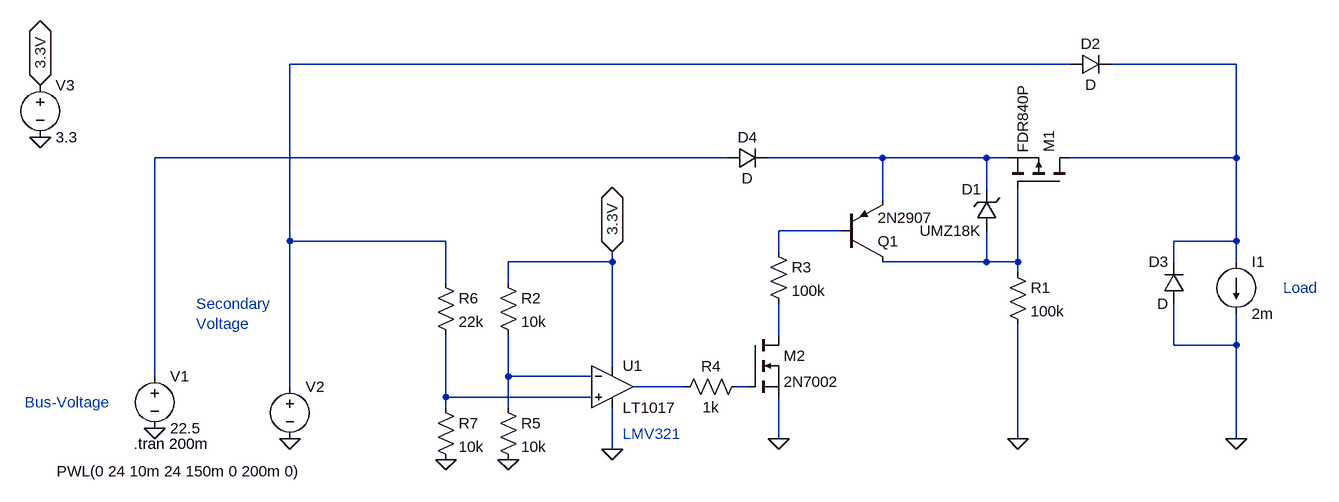
[diagram p0: schematic BusVoltage_Cutoff_OPA.asc]
BusVoltage_Cutoff_OPA.asc, the LTspice schematic file:
Version 4
SHEET 1 1240 680
WIRE 464 -368 -736 -368
WIRE 720 -368 528 -368
WIRE -64 -224 -944 -224
WIRE 176 -224 0 -224
WIRE 336 -224 176 -224
WIRE 368 -224 336 -224
WIRE 720 -224 720 -368
WIRE 720 -224 464 -224
WIRE 336 -176 336 -224
WIRE 176 -160 176 -224
WIRE 112 -112 16 -112
WIRE -736 -96 -736 -368
WIRE -496 -96 -736 -96
WIRE 720 -96 720 -224
WIRE 720 -96 624 -96
WIRE 16 -80 16 -112
WIRE -240 -64 -240 -80
WIRE -240 -64 -400 -64
WIRE 336 -64 336 -112
WIRE 336 -64 176 -64
WIRE 384 -64 384 -176
WIRE 384 -64 336 -64
WIRE 624 -64 624 -96
WIRE 720 -64 720 -96
WIRE 384 -48 384 -64
WIRE -496 -32 -496 -96
WIRE -400 -32 -400 -64
WIRE 16 48 16 0
WIRE 624 64 624 0
WIRE 720 64 720 16
WIRE 720 64 624 64
WIRE -240 96 -240 -64
WIRE -944 112 -944 -224
WIRE -400 112 -400 48
WIRE -272 112 -400 112
WIRE -736 128 -736 -96
WIRE -128 128 -208 128
WIRE -32 128 -48 128
WIRE -496 144 -496 48
WIRE -272 144 -496 144
WIRE -496 160 -496 144
WIRE -400 160 -400 112
WIRE 16 208 16 144
WIRE 384 208 384 32
WIRE 720 208 720 64
WIRE -240 224 -240 160
FLAG -944 192 0
FLAG 384 208 0
FLAG 720 208 0
FLAG -736 208 0
FLAG 16 208 0
FLAG -240 224 0
FLAG -1120 -256 0
FLAG -1120 -336 3.3V
IOPIN -1120 -336 BiDir
FLAG -240 -80 3.3V
IOPIN -240 -80 BiDir
FLAG -400 240 0
FLAG -496 240 0
SYMBOL voltage -944 96 R0
WINDOW 123 0 0 Left 0
WINDOW 39 0 0 Left 0
SYMATTR InstName V1
SYMATTR Value 22.5
SYMBOL pmos 464 -176 M270
SYMATTR InstName M1
SYMATTR Value FDR840P
SYMBOL res 368 -64 R0
SYMATTR InstName R1
SYMATTR Value 100k
SYMBOL pnp 112 -64 M180
SYMATTR InstName Q1
SYMATTR Value 2N2907
SYMBOL voltage -736 112 R0
WINDOW 3 -359 146 Left 2
WINDOW 123 0 0 Left 0
WINDOW 39 0 0 Left 0
SYMATTR Value PWL(0 24 10m 24 150m 0 200m 0)
SYMATTR InstName V2
SYMBOL zener 352 -112 R180
WINDOW 0 24 64 Left 2
WINDOW 3 24 0 Left 2
SYMATTR InstName D1
SYMATTR Value UMZ18K
SYMBOL diode 464 -352 R270
WINDOW 0 32 32 VTop 2
WINDOW 3 0 32 VBottom 2
SYMATTR InstName D2
SYMBOL res 0 -96 R0
SYMATTR InstName R3
SYMATTR Value 100k
SYMBOL current 720 -64 R0
WINDOW 123 0 0 Left 0
WINDOW 39 0 0 Left 0
SYMATTR InstName I1
SYMATTR Value 2m
SYMBOL diode -64 -208 R270
WINDOW 0 32 32 VTop 2
WINDOW 3 0 32 VBottom 2
SYMATTR InstName D4
SYMBOL diode 640 0 R180
WINDOW 0 24 64 Left 2
WINDOW 3 24 0 Left 2
SYMATTR InstName D3
SYMBOL Comparators\\LT1017 -240 128 R0
SYMATTR InstName U1
SYMBOL voltage -1120 -352 R0
WINDOW 123 0 0 Left 0
WINDOW 39 0 0 Left 0
SYMATTR InstName V3
SYMATTR Value 3.3
SYMBOL res -32 112 R90
WINDOW 0 0 56 VBottom 2
WINDOW 3 32 56 VTop 2
SYMATTR InstName R4
SYMATTR Value 1k
SYMBOL nmos -32 48 R0
SYMATTR InstName M2
SYMATTR Value 2N7002
SYMBOL res -416 -48 R0
SYMATTR InstName R2
SYMATTR Value 10k
SYMBOL res -416 144 R0
SYMATTR InstName R5
SYMATTR Value 10k
SYMBOL res -512 -48 R0
SYMATTR InstName R6
SYMATTR Value 22k
SYMBOL res -512 144 R0
SYMATTR InstName R7
SYMATTR Value 10k
TEXT 792 -24 Left 2 ;Load
TEXT -976 216 Left 2 !.tran 200m
TEXT -1144 152 Left 2 ;Bus-Voltage
TEXT -880 0 Left 2 ;Secondary\nVoltage
TEXT -224 200 Left 2 ;LMV321

The netlist it stands for:
* BusVoltage_Cutoff_OPA.asc
V1 N003 0 22.5
M1 N002 N006 N004 N004 FDR840P
R1 N006 0 100k
Q1 N006 N005 N004 0 2N2907
V2 N001 0 PWL(0 24 10m 24 150m 0 200m 0)
D1 N006 N004 UMZ18K
D2 N001 N002 D
R3 N005 N007 100k
I1 N002 0 2m
D4 N003 N004 D
D3 0 N002 D
XU1 N011 N008 3.3V 0 N009 LT1017  ; pins In+ In- V+ V- OUT
V3 3.3V 0 3.3
R4 N010 N009 1k
M2 N007 N010 0 0 2N7002
R2 3.3V N008 10k
R5 N008 0 10k
R6 N001 N011 22k
R7 N011 0 10k
.model D D
.lib standard.dio
.model NPN NPN
.model PNP PNP
.lib standard.bjt
.model NMOS NMOS
.model PMOS PMOS
.lib standard.mos
* Load
.tran 200m
* Bus-Voltage
* Secondary
* Voltage
* LMV321
.backanno
.end